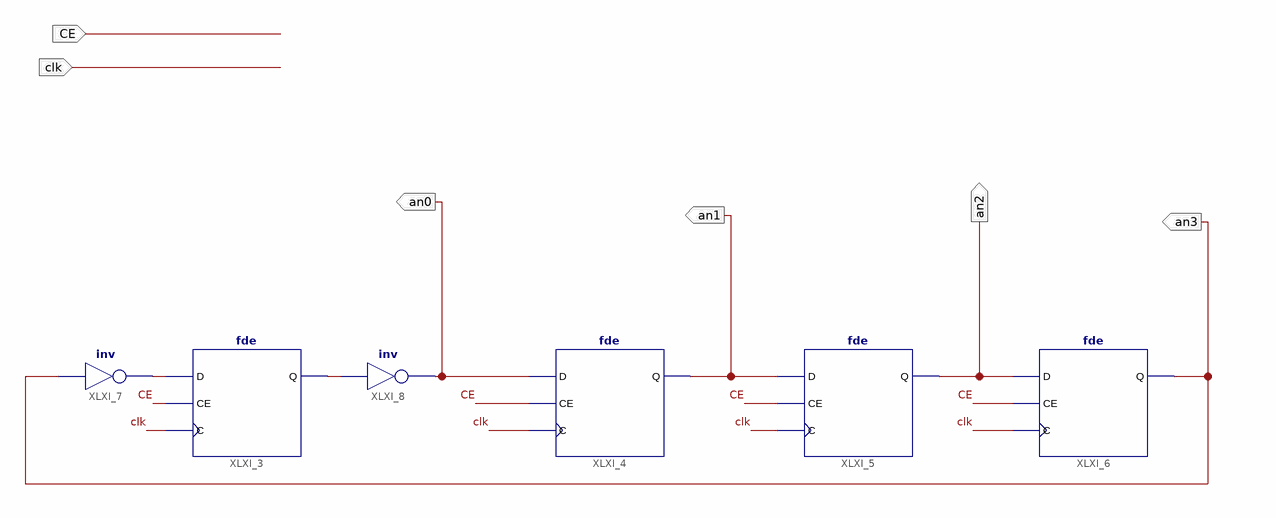
[diagram p0: schematic sheet 1]
// Xilinx ISE schematic ringcounter.sch (spartan3e) as structural Verilog: 6 symbols, 6 ports
module ringcounter (
  input  CE,
  input  clk,
  output an0,
  output an1,
  output an2,
  output an3
);

  wire XLXN_1, XLXN_3;

  fde XLXI_4 (.C(clk), .CE(CE), .D(an0), .Q(an1));
  fde XLXI_5 (.C(clk), .CE(CE), .D(an1), .Q(an2));
  fde XLXI_6 (.C(clk), .CE(CE), .D(an2), .Q(an3));
  fde XLXI_3 (.C(clk), .CE(CE), .D(XLXN_1), .Q(XLXN_3));
  not XLXI_7 (XLXN_1, an3);
  not XLXI_8 (an0, XLXN_3);
endmodule
